# EAGLE schematic Steuerungsmodul (EAGLE 9.6.2)
BRD_SHEET_NAME: Schaltplan; PROJEKT_NAME: Verstärker_Innovativwoche; REVISION: 1.1; SCH_SHEET_NAME: Steuerungsmodul Verstärker; USER_NAME: Melcher-Millner/Scheffknecht

## Sheet 1 of 2: Input Switch
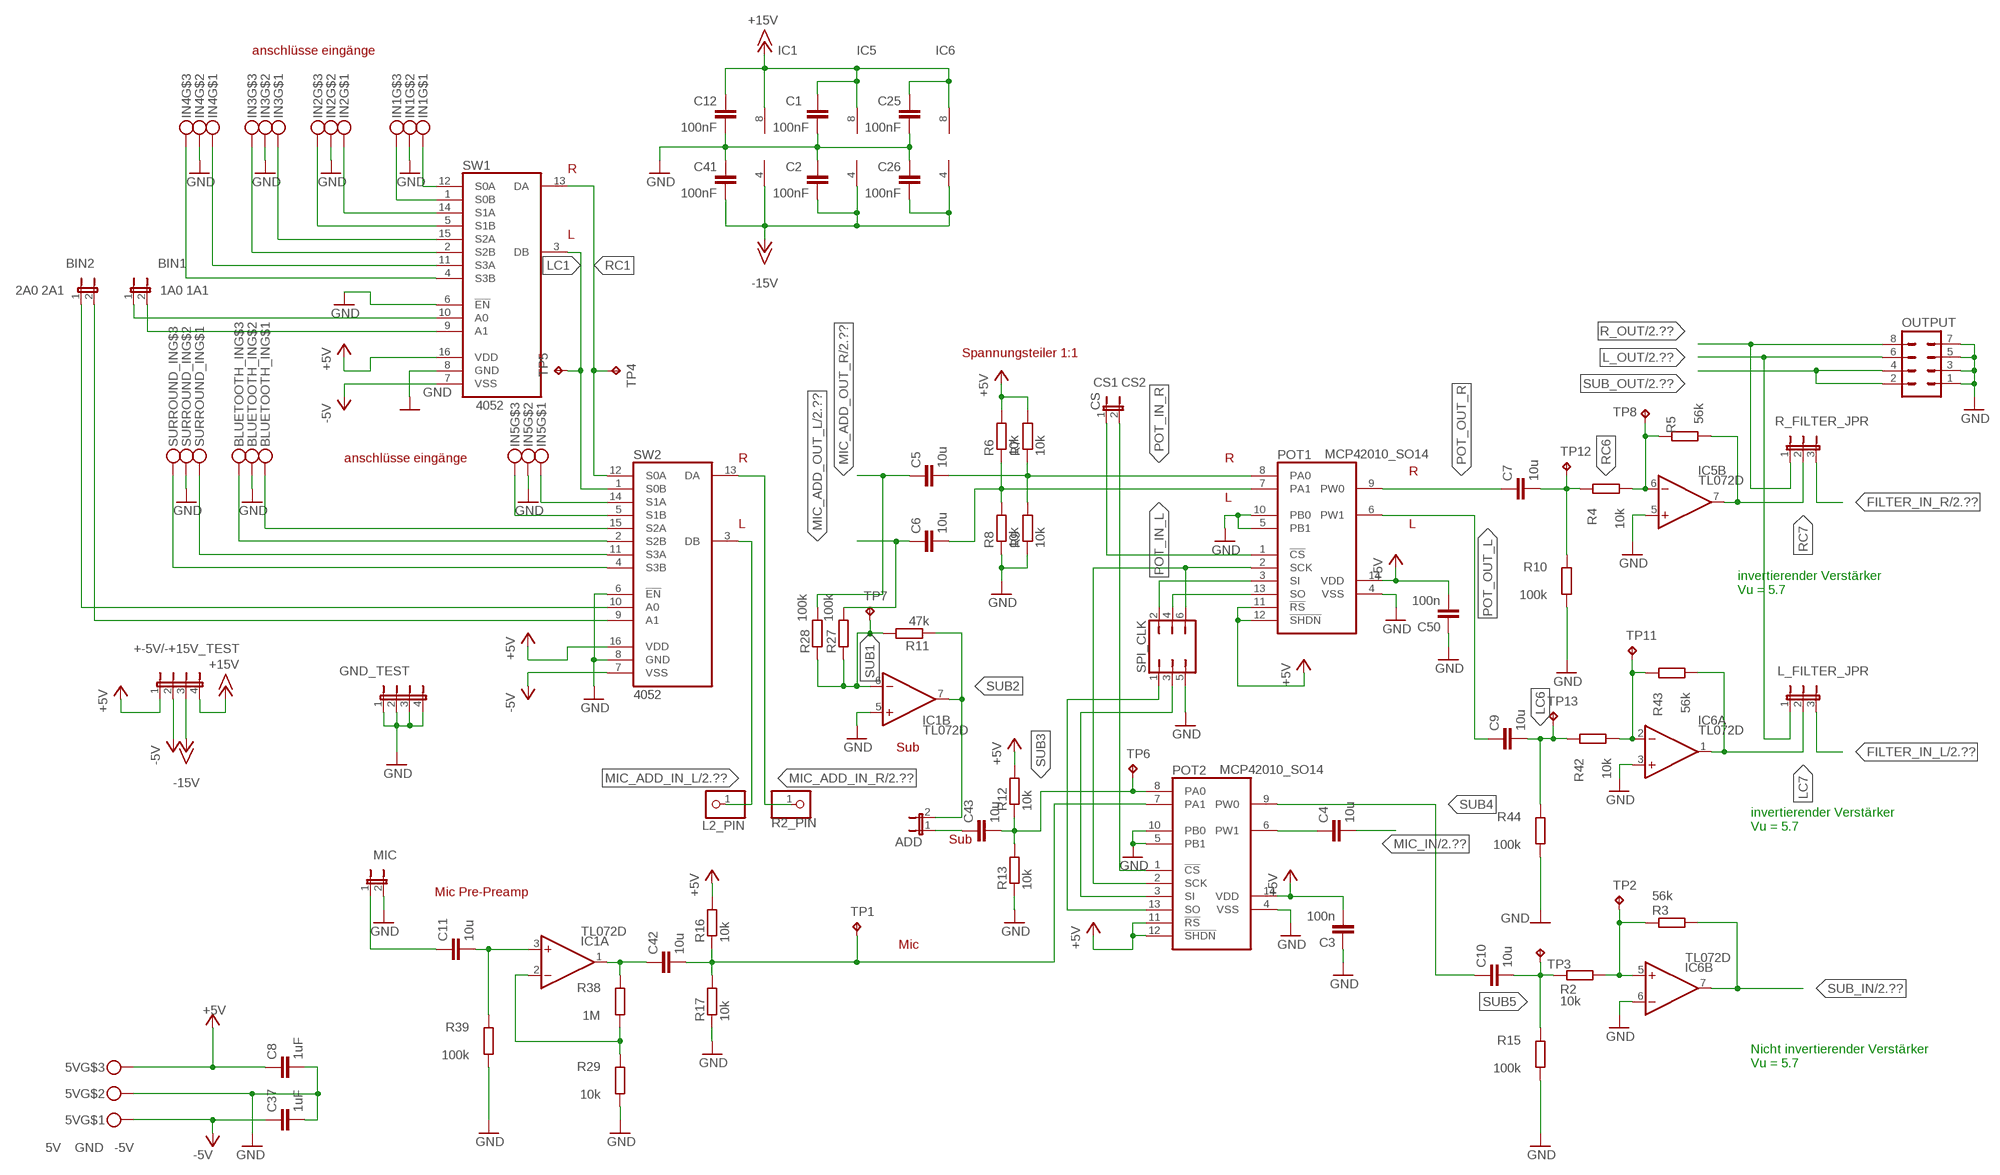
[diagram p0: schematic, sheet 1]

### Parts
5V  5V GND -5V  MKDS3/3_5,08  [MKDS3/3_5,08]
+-5V/-+15V_TEST  JP4E  [JP4]
ADD  JMP2  [JMP2]
BIN1  1A0 1A1  JMP2  [JMP2]
BIN2  2A0 2A1  JMP2  [JMP2]
BLUETOOTH_IN  MKDS3/3_5,08  [MKDS3/3_5,08]
C1  100nF  C-EUC0805  [C0805]
C2  100nF  C-EUC0805  [C0805]
C3  100n  C-EUC0805  [C0805]
C4  10u  C-EUC0805  [C0805]
C5  10u  C-EUC0805  [C0805]
C6  10u  C-EUC0805  [C0805]
C7  10u  C-EUC0805  [C0805]
C8  1uF  C-EUC0805  [C0805]
C9  10u  C-EUC0805  [C0805]
C10  10u  C-EUC0805  [C0805]
C11  10u  C-EUC0805  [C0805]
C12  100nF  C-EUC0805  [C0805]
C25  100nF  C-EUC0805  [C0805]
C26  100nF  C-EUC0805  [C0805]
C37  1uF  C-EUC0805  [C0805]
C41  100nF  C-EUC0805  [C0805]
C42  10u  C-EUC0805  [C0805]
C43  10u  C-EUC0805  [C0805]
C50  100n  C-EUC0805  [C0805]
CS  CS1 CS2  JMP2  [JMP2]
GND_TEST  JP4E  [JP4]
IC1  TL072D  [SO08]
IC5  TL072D  [SO08]
IC6  TL072D  [SO08]
IN1  MKDS3/3_5,08  [MKDS3/3_5,08]
IN2  MKDS3/3_5,08  [MKDS3/3_5,08]
IN3  MKDS3/3_5,08  [MKDS3/3_5,08]
IN4  MKDS3/3_5,08  [MKDS3/3_5,08]
IN5  MKDS3/3_5,08  [MKDS3/3_5,08]
L2_PIN  PINHD-1X1  [1X01]
L_FILTER_JPR  JMP3  [JMP3]
MIC  JMP2  [JMP2]
OUTPUT  MA04-2  [MA04-2]
POT1  MCP42010_SO14  [SO14]
POT2  MCP42010_SO14  [SO14]
R2  10k  R-EU_M0805  [M0805]
R2_PIN  PINHD-1X1  [1X01]
R3  56k  R-EU_M0805  [M0805]
R4  10k  R-EU_M0805  [M0805]
R5  56k  R-EU_M0805  [M0805]
R6  10k  R-EU_M0805  [M0805]
R7  10k  R-EU_M0805  [M0805]
R8  10k  R-EU_M0805  [M0805]
R9  10k  R-EU_M0805  [M0805]
R10  100k  R-EU_M0805  [M0805]
R11  47k  R-EU_M0805  [M0805]
R12  10k  R-EU_M0805  [M0805]
R13  10k  R-EU_M0805  [M0805]
R15  100k  R-EU_M0805  [M0805]
R16  10k  R-EU_M0805  [M0805]
R17  10k  R-EU_M0805  [M0805]
R27  100k  R-EU_M0805  [M0805]
R28  100k  R-EU_M0805  [M0805]
R29  10k  R-EU_M0805  [M0805]
R38  1M  R-EU_M0805  [M0805]
R39  100k  R-EU_M0805  [M0805]
R42  10k  R-EU_M0805  [M0805]
R43  56k  R-EU_M0805  [M0805]
R44  100k  R-EU_M0805  [M0805]
R_FILTER_JPR  JMP3  [JMP3]
SPI_CLK  JP3Q  [JP3Q]
SURROUND_IN  MKDS3/3_5,08  [MKDS3/3_5,08]
SW1  4052  5042_SO16_NEU  [SO-16]
SW2  4052  5042_SO16_NEU  [SO-16]
TP1  TPB2,54  [B2,54]
TP2  TPB2,54  [B2,54]
TP3  TPB2,54  [B2,54]
TP4  TPB2,54  [B2,54]
TP5  TPB2,54  [B2,54]
TP6  TPB2,54  [B2,54]
TP7  TPB2,54  [B2,54]
TP8  TPB2,54  [B2,54]
TP11  TPB2,54  [B2,54]
TP12  TPB2,54  [B2,54]
TP13  TPB2,54  [B2,54]

### Nets
1A0: BIN1.1 SW1.10(A0)
1A1: BIN1.2 SW1.9(A1)
2A0: BIN2.1 SW2.10(A0)
2A1: BIN2.2 SW2.9(A1)
+5V: 5V.P$3 +-5V/-+15V_TEST.1 C3.2 C8.1 C50.2 POT1.11(!RS) POT1.12(!SHDN) POT1.14(VDD) POT2.11(!RS) POT2.12(!SHDN) POT2.14(VDD) R6.2 R7.2 R12.2 R16.2 SW1.16(VDD) SW2.16(VDD)
+15V: +-5V/-+15V_TEST.4 C1.1 C12.1 C25.1 IC1.8(P:V+) IC5.8(P:V+) IC6.8(P:V+) ; also sheet 2
-5V: 5V.P$1 +-5V/-+15V_TEST.2 C37.1 SW1.7(VSS) SW2.7(VSS)
-15V: +-5V/-+15V_TEST.3 C2.2 C26.2 C41.2 IC1.4(P:V-) IC5.4(P:V-) IC6.4(P:V-) ; also sheet 2
FILTER_IN_L: L_FILTER_JPR.3 ; also sheet 2
FILTER_IN_R: R_FILTER_JPR.3 ; also sheet 2
GND: 5V.P$2 BLUETOOTH_IN.P$2 C1.2 C2.1 C3.1 C8.2 C12.2 C25.2 C26.1 C37.2 C41.1 C50.1 GND_TEST.1 GND_TEST.2 GND_TEST.3 GND_TEST.4 IC1.5(B:+IN) IC5.5(B:+IN) IC6.3(A:+IN) IC6.6(B:-IN) IN1.P$2 IN2.P$2 IN3.P$2 IN4.P$2 IN5.P$2 MIC.2 OUTPUT.1 OUTPUT.3 OUTPUT.5 OUTPUT.7 POT1.4(VSS) POT1.5(PB1) POT1.10(PB0) POT2.4(VSS) POT2.5(PB1) POT2.10(PB0) R8.1 R9.1 R10.1 R13.1 R15.1 R17.1 R29.1 R39.1 R44.1 SPI_CLK.5 SURROUND_IN.P$2 SW1.6(!EN) SW1.8(GND) SW2.6(!EN) SW2.8(GND) ; also sheet 2
L_OUT: L_FILTER_JPR.1 OUTPUT.6 ; also sheet 2
LC1: SW1.3(DB) SW2.1(S0B) TP5.TP
LC6: C9.2 R42.2 R44.2 TP13.TP
LC7: IC6.1(A:OUT) L_FILTER_JPR.2 R43.1
MIC_ADD_IN_L: L2_PIN.1 SW2.3(DB) ; also sheet 2
MIC_ADD_IN_R: R2_PIN.1 SW2.13(DA) ; also sheet 2
MIC_ADD_OUT_L: C6.1 R27.2 ; also sheet 2
MIC_ADD_OUT_R: C5.1 R28.2 ; also sheet 2
MIC_IN: C4.2 ; also sheet 2
N$1: CS.2 POT2.1(!CS)
N$2: CS.1 POT1.1(!CS)
N$3: IC6.5(B:+IN) R2.1 R3.2 TP2.TP
N$5: IC5.6(B:-IN) R4.1 R5.2 TP8.TP
N$7: IC6.2(A:-IN) R42.1 R43.2 TP11.TP
N$10: POT1.3(SI) SPI_CLK.2
N$26: POT2.13(SO) SPI_CLK.1
N$30: C11.1 MIC.1
N$31: POT1.13(SO) SPI_CLK.4
N$32: POT2.3(SI) SPI_CLK.3
N$34: C4.1 POT2.6(PW1)
N$36: C42.2 POT2.7(PA1) R16.1 R17.2 TP1.TP
N$37: POT1.2(SCK) POT2.2(SCK) SPI_CLK.6
N$38: IN1.P$1 SW1.12(S0A)
N$39: IN1.P$3 SW1.1(S0B)
N$40: IN2.P$1 SW1.14(S1A)
N$41: IN2.P$3 SW1.5(S1B)
N$42: IN3.P$1 SW1.15(S2A)
N$43: IN3.P$3 SW1.2(S2B)
N$44: IN4.P$1 SW1.11(S3A)
N$45: IN4.P$3 SW1.4(S3B)
N$46: IN5.P$1 SW2.14(S1A)
N$47: IN5.P$3 SW2.5(S1B)
N$48: BLUETOOTH_IN.P$1 SW2.15(S2A)
N$49: BLUETOOTH_IN.P$3 SW2.2(S2B)
N$50: SURROUND_IN.P$1 SW2.11(S3A)
N$51: SURROUND_IN.P$3 SW2.4(S3B)
N$53: C11.2 IC1.3(A:+IN) R39.2
N$62: IC1.2(A:-IN) R29.2 R38.1
N$64: ADD.1 C43.1
N$71: C42.1 IC1.1(A:OUT) R38.2
POT_IN_L: C6.2 POT1.7(PA1) R6.1 R8.2
POT_IN_R: C5.2 POT1.8(PA0) R7.1 R9.2
POT_OUT_L: C9.1 POT1.6(PW1)
POT_OUT_R: C7.1 POT1.9(PW0)
R_OUT: OUTPUT.8 R_FILTER_JPR.1 ; also sheet 2
RC1: SW1.13(DA) SW2.12(S0A) TP4.TP
RC6: C7.2 R4.2 R10.2 TP12.TP
RC7: IC5.7(B:OUT) R5.1 R_FILTER_JPR.2
SUB1: IC1.6(B:-IN) R11.2 R27.1 R28.1 TP7.TP
SUB2: ADD.2 IC1.7(B:OUT) R11.1
SUB3: C43.2 POT2.8(PA0) R12.1 R13.2 TP6.TP
SUB4: C10.1 POT2.9(PW0)
SUB5: C10.2 R2.2 R15.2 TP3.TP
SUB_IN: IC6.7(B:OUT) R3.1 ; also sheet 2
SUB_OUT: OUTPUT.2 OUTPUT.4 ; also sheet 2
Unconnected: IC5.1(A:OUT) IC5.2(A:-IN) IC5.3(A:+IN)

### Notes on the sheet
- anschlüsse eingänge | IC1 | IC5 | IC6
- R
- L
- Spannungsteiler 1:1
- anschlüsse eingänge | R | R
- R
- L
- L | L
- invertierender Verstärker
  Vu = 5.7
- Sub
- invertierender Verstärker
  Vu = 5.7
- Sub
- Mic Pre-Preamp
- Mic
- Nicht invertierender Verstärker
  Vu = 5.7

## Sheet 2 of 2: Aktivfilter
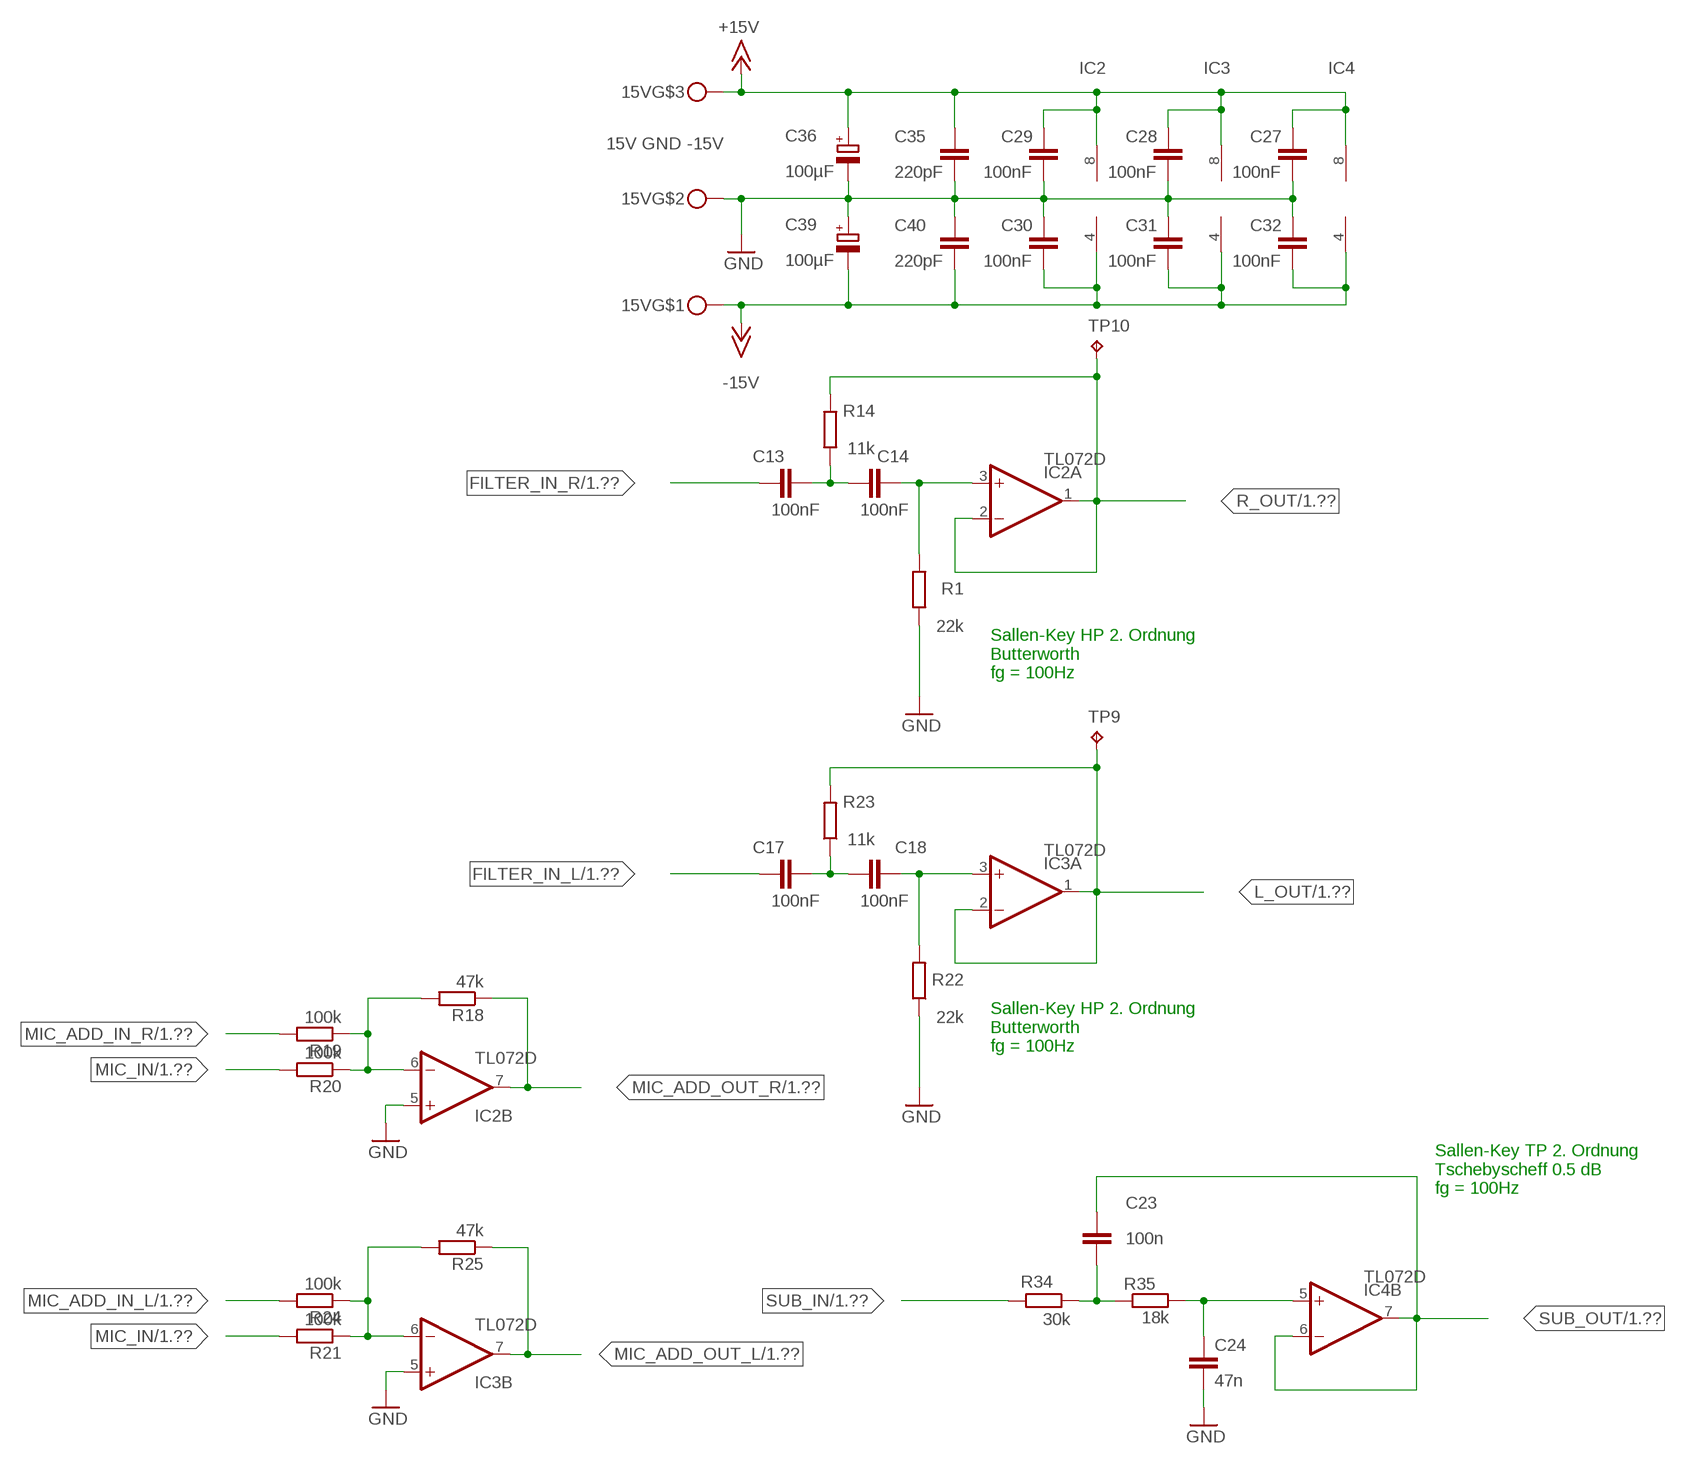
[diagram p1: schematic, sheet 2]

### Parts
15V  15V GND -15V  MKDS3/3_5,08  [MKDS3/3_5,08]
C13  100nF  C-EUC0805  [C0805]
C14  100nF  C-EUC0805  [C0805]
C17  100nF  C-EUC0805  [C0805]
C18  100nF  C-EUC0805  [C0805]
C23  100n  C-EUC0805  [C0805]
C24  47n  C-EUC0805  [C0805]
C27  100nF  C-EUC0805  [C0805]
C28  100nF  C-EUC0805  [C0805]
C29  100nF  C-EUC0805  [C0805]
C30  100nF  C-EUC0805  [C0805]
C31  100nF  C-EUC0805  [C0805]
C32  100nF  C-EUC0805  [C0805]
C35  220pF  C-EUC0805  [C0805]
C36  100µF  CPOL-EUE2.5-6  [E2,5-6]
C39  100µF  CPOL-EUE2.5-6  [E2,5-6]
C40  220pF  C-EUC0805  [C0805]
IC2  TL072D  [SO08]
IC3  TL072D  [SO08]
IC4  TL072D  [SO08]
R1  22k  R-EU_M0805  [M0805]
R14  11k  R-EU_M0805  [M0805]
R18  47k  R-EU_M0805  [M0805]
R19  100k  R-EU_M0805  [M0805]
R20  100k  R-EU_M0805  [M0805]
R21  100k  R-EU_M0805  [M0805]
R22  22k  R-EU_M0805  [M0805]
R23  11k  R-EU_M0805  [M0805]
R24  100k  R-EU_M0805  [M0805]
R25  47k  R-EU_M0805  [M0805]
R34  30k  R-EU_M0805  [M0805]
R35  18k  R-EU_M0805  [M0805]
TP9  TPB2,54  [B2,54]
TP10  TPB2,54  [B2,54]

### Nets
+15V: 15V.P$3 C27.1 C28.1 C29.1 C35.1 C36.+ IC2.8(P:V+) IC3.8(P:V+) IC4.8(P:V+) ; also sheet 1
-15V: 15V.P$1 C30.2 C31.2 C32.2 C39.- C40.2 IC2.4(P:V-) IC3.4(P:V-) IC4.4(P:V-) ; also sheet 1
FILTER_IN_L: C17.1 ; also sheet 1
FILTER_IN_R: C13.1 ; also sheet 1
GND: 15V.P$2 C24.2 C27.2 C28.2 C29.2 C30.1 C31.1 C32.1 C35.2 C36.- C39.+ C40.1 IC2.5(B:+IN) IC3.5(B:+IN) R1.1 R22.1 ; also sheet 1
L_OUT: IC3.1(A:OUT) IC3.2(A:-IN) R23.2 TP9.TP ; also sheet 1
MIC_ADD_IN_L: R24.2 ; also sheet 1
MIC_ADD_IN_R: R19.2 ; also sheet 1
MIC_ADD_OUT_L: IC3.7(B:OUT) R25.1 ; also sheet 1
MIC_ADD_OUT_R: IC2.7(B:OUT) R18.1 ; also sheet 1
MIC_IN: R20.2 R21.2 ; also sheet 1
N$4: IC3.6(B:-IN) R21.1 R24.1 R25.2
N$6: IC2.6(B:-IN) R18.2 R19.1 R20.1
N$57: C14.2 IC2.3(A:+IN) R1.2
N$58: C13.2 C14.1 R14.1
N$66: C18.2 IC3.3(A:+IN) R22.2
N$67: C17.2 C18.1 R23.1
N$78: C24.1 IC4.5(B:+IN) R35.2
N$79: C23.2 R34.1 R35.1
R_OUT: IC2.1(A:OUT) IC2.2(A:-IN) R14.2 TP10.TP ; also sheet 1
SUB_IN: R34.2 ; also sheet 1
SUB_OUT: C23.1 IC4.6(B:-IN) IC4.7(B:OUT) ; also sheet 1
Unconnected: IC4.1(A:OUT) IC4.2(A:-IN) IC4.3(A:+IN)

### Notes on the sheet
- IC2 | IC3 | IC4
- Sallen-Key HP 2. Ordnung
  Butterworth
  fg = 100Hz
- Sallen-Key HP 2. Ordnung
  Butterworth
  fg = 100Hz
- Sallen-Key TP 2. Ordnung
  Tschebyscheff 0.5 dB
  fg = 100Hz

## Library data of the parts
5V 15V BLUETOOTH_IN IN1-IN5 SURROUND_IN = 0_HTL_elektro:MKDS3/3_5,08: Leiterplattenklemme 3-polig
+-5V/-+15V_TEST GND_TEST = jumper:JP4E: JUMPER
ADD BIN1 CS MIC = 0_HTL_elektro:JMP2: Jumper 2-polig
BIN2 = 0_HTL_elektro:JMP2: Jumper 2-polig; SPICEPREFIX: B
C1-C14 C17 C18 C23-C32 C35 C37 C40-C43 C50 = rcl:C-EU: CAPACITOR, European symbol; SPICEPREFIX: C
C36 C39 = rcl:CPOL-EU: POLARIZED CAPACITOR, European symbol; SPICEPREFIX: C
IC1-IC6 = linear:TL072: OP AMP
L2_PIN R2_PIN = pinhead:PINHD-1X1: PIN HEADER
L_FILTER_JPR R_FILTER_JPR = 0_HTL_elektro:JMP3: Jumper 3-polig
OUTPUT = con-lstb:MA04-2: PIN HEADER; OC_FARNELL: unknown; OC_NEWARK: unknown
POT1 POT2 = 0_Custom-Lib_Verstärker:MCP42010_SO14
R1-R25 R27-R29 R34 R35 R38 R39 R42-R44 = rcl:R-EU_: RESISTOR, European symbol; SPICEPREFIX: R
SPI_CLK = jumper:JP3Q: JUMPER
SW1 SW2 = 0_Custom-Lib_Verstärker:5042_SO16_NEU
TP1-TP13 = testpad:TP: Test pad